# EAGLE design R2R_v2.1 (EAGLE 9.6.2)
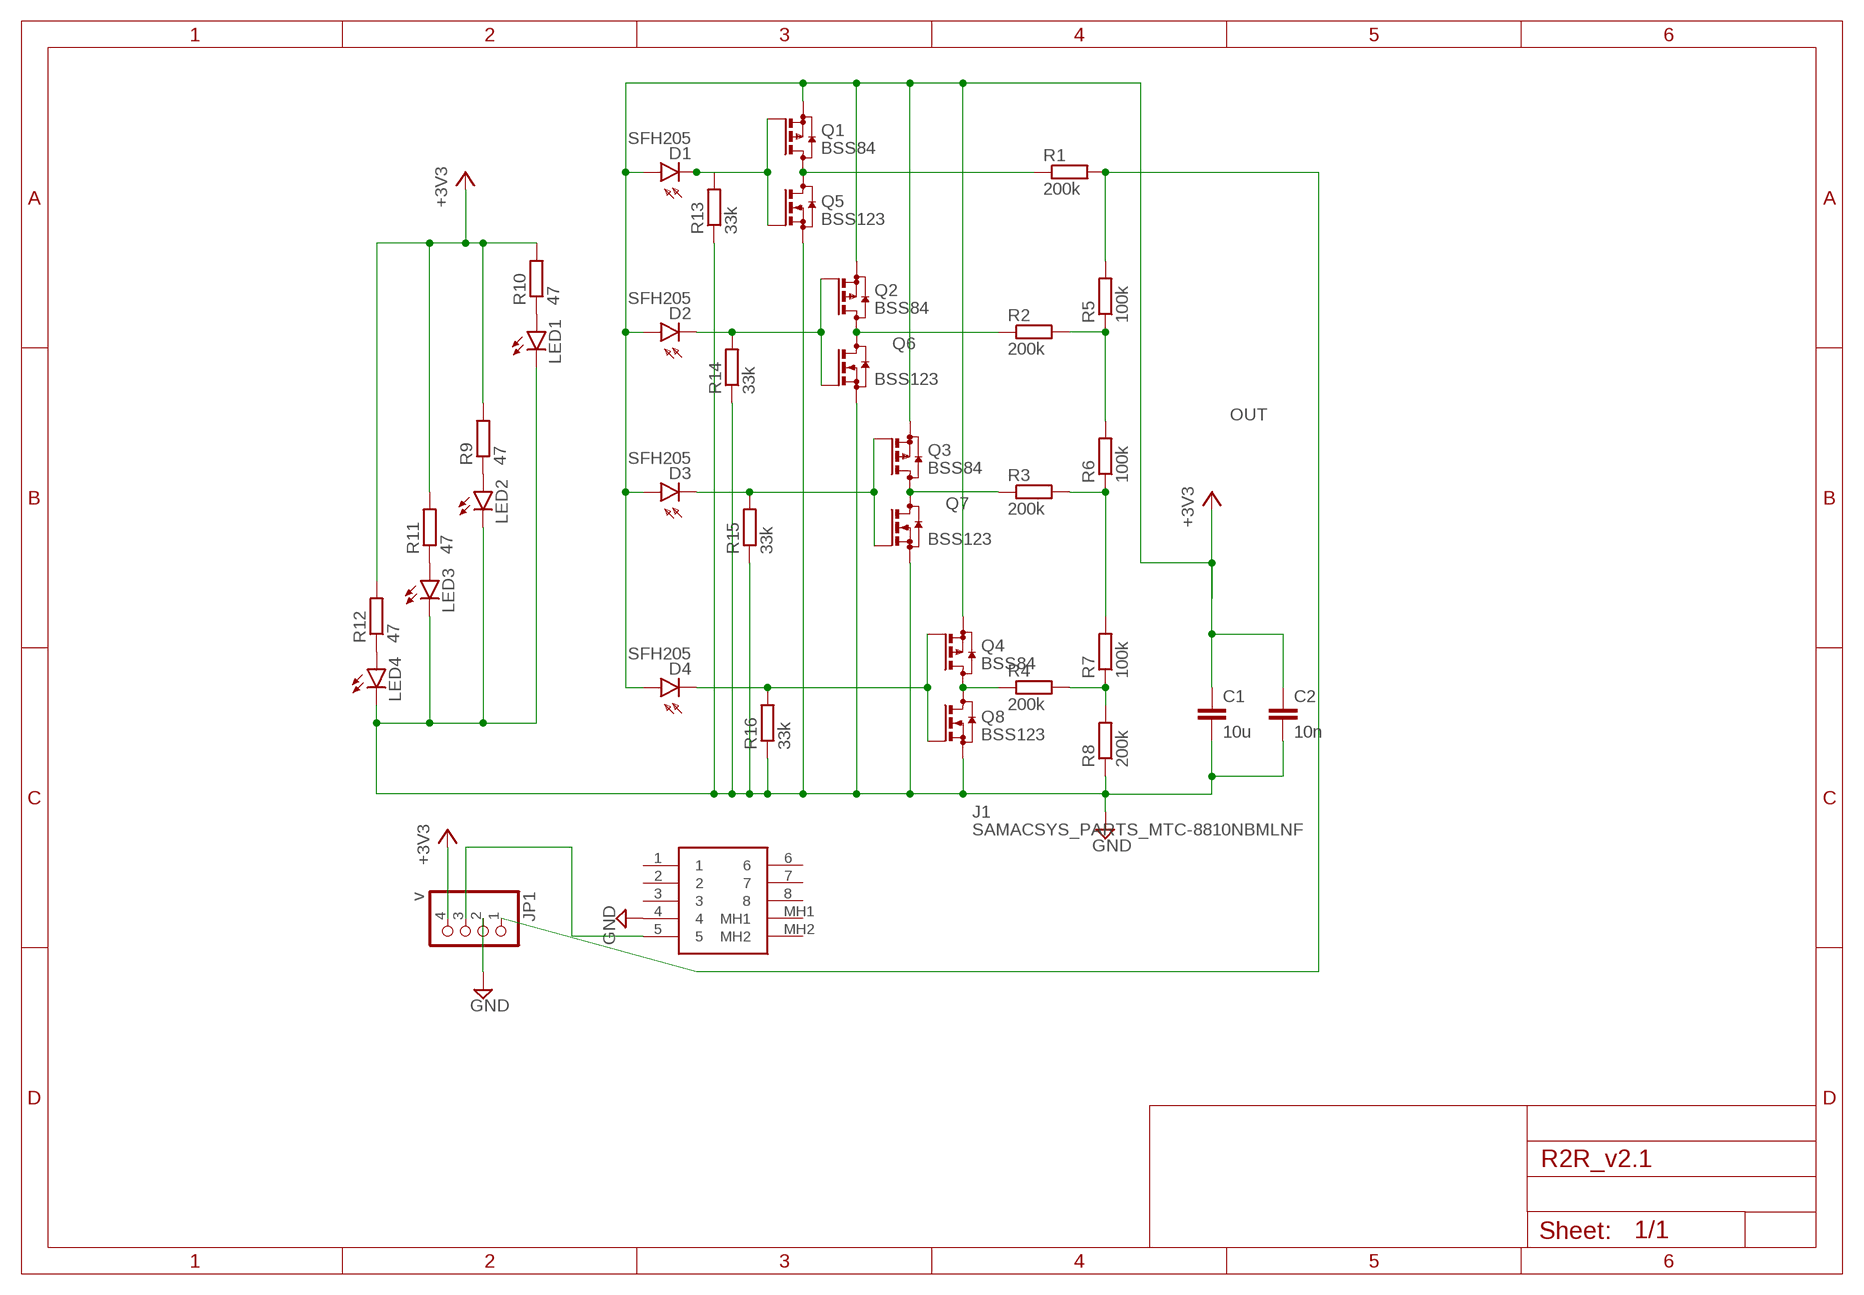
[diagram p0: schematic, sheet 1]

## Parts
C1  10u  C-EUC0805  [C0805]
C2  10n  C-EUC0805  [C0805]
D1  SFH205  [SFH205]
D2  SFH205  [SFH205]
D3  SFH205  [SFH205]
D4  SFH205  [SFH205]
J1  SAMACSYS_PARTS_MTC-8810NBMLNF  [SAMACSYS_PARTS_MTC8810NBMLNF]
JP1  v  PINHD-1X4  [1X04]
LED1  LED3MM  [LED3MM]
LED2  LED3MM  [LED3MM]
LED3  LED3MM  [LED3MM]
LED4  LED3MM  [LED3MM]
Q1  BSS84  [SOT23]
Q2  BSS84  [SOT23]
Q3  BSS84  [SOT23]
Q4  BSS84  [SOT23]
Q5  BSS123  [SOT23]
Q6  BSS123  [SOT23]
Q7  BSS123  [SOT23]
Q8  BSS123  [SOT23]
R1  200k  R-EU_R1206  [R1206]
R2  200k  R-EU_R1206  [R1206]
R3  200k  R-EU_R1206  [R1206]
R4  200k  R-EU_R1206  [R1206]
R5  100k  R-EU_R1206  [R1206]
R6  100k  R-EU_R1206  [R1206]
R7  100k  R-EU_R1206  [R1206]
R8  200k  R-EU_R1206  [R1206]
R9  47  R-EU_R1206  [R1206]
R10  47  R-EU_R1206  [R1206]
R11  47  R-EU_R1206  [R1206]
R12  47  R-EU_R1206  [R1206]
R13  33k  R-EU_R1206  [R1206]
R14  33k  R-EU_R1206  [R1206]
R15  33k  R-EU_R1206  [R1206]
R16  33k  R-EU_R1206  [R1206]

## Nets
+3V3: C1.1 C2.1 D1.A D2.A D3.A D4.A JP1.4 Q1.2(S) Q2.2(S) Q3.2(S) Q4.2(S) R9.2 R10.2 R11.2 R12.2
GND: C1.2 C2.2 J1.4 JP1.2 LED1.K(C) LED2.K(C) LED3.K(C) LED4.K(C) Q5.2(S) Q6.2(S) Q7.2(S) Q8.2(S) R8.1 R13.1 R14.1 R15.1 R16.1
N$1: Q1.3(D) Q5.3(D) R1.1
N$2: R2.2 R5.1 R6.2
N$3: R3.2 R6.1 R7.2
N$4: R4.2 R7.1 R8.2
N$5: D4.K(C) Q4.1(G) Q8.1(G) R16.2
N$6: Q3.3(D) Q7.3(D) R3.1
N$7: D2.K(C) Q2.1(G) Q6.1(G) R14.2
N$8: D1.K(C) Q1.1(G) Q5.1(G) R13.2
N$9: LED1.A R10.1
N$10: LED2.A R9.1
N$11: LED3.A R11.1
N$12: LED4.A R12.1
N$13: Q2.3(D) Q6.3(D) R2.1
N$14: J1.5 JP1.3
N$15: D3.K(C) Q3.1(G) Q7.1(G) R15.2
N$16: Q4.3(D) Q8.3(D) R4.1
OUT: JP1.1 R1.2 R5.2
Unconnected: J1.1 J1.2 J1.3 J1.6 J1.7 J1.8 J1.MH1 J1.MH2

## Library data of the parts
C1 C2 = rcl:C-EU: CAPACITOR, European symbol; SPICEPREFIX: C
D1-D4 = opto-trans-siemens:SFH205: PHOTO DIODE; OC_FARNELL: unknown; OC_NEWARK: unknown
J1 = Samac-RJ45:SAMACSYS_PARTS_MTC-8810NBMLNF: RS PRO Female Cat5 RJ45 Connector, PCB Mount RS Pro Cat5 RJ45 Connector Socket, Unshielded, Right Angle, PCB Mount Source: Datasheet <https://docs.rs-online.com/6e50/0900766b815bdd23.pdf>; DESCRIPTION: RS PRO Female Cat5 RJ45 Connector, PCB Mount RS Pro Cat5 RJ45 Connector Socket, Unshielded, Right Angle, PCB Mount; HEIGHT: 14.5mm; MANUFACTURER_NAME: RS Components; MANUFACTURER_PART_NUMBER: MTC-8810NBMLNF
JP1 = pinhead:PINHD-1X4: PIN HEADER
LED1-LED4 = led:LED: LED OSRAM: - CHIPLED LG R971, LG N971, LY N971, LG Q971, LY Q971, LO R971, LY R971 LH N974, LH R974 LS Q976, LO Q976, LY Q976 LO Q996 - Hyper CHIPLED LW Q18S LB Q993, LB Q99A, LB R99A - SideLED LS A670, LO A670, LY A670, LG A670, LP A670 LB A673, LV A673, LT A673, LW A673 LH A674 LY A675 LS A676, LA A676, LO A676, LY A676, LW A676 LS A679, LY A679, LG A679 - Hyper Micro SIDELED® LS Y876, LA Y876, LO Y876, LY Y876 LT Y87S - SmartLED LW L88C, LW L88S LB L89C, LB L89S, LG L890 LS L89K, LO L89K, LY L89K LS L896, LA L896, LO L896, LY L896 - TOPLED LS T670, LO T670, LY T670, LG T670, LP T670 LSG T670, LSP T670, LSY T670, LOP T670, LYG T670 LG T671, LOG T671, LSG T671 LB T673, LV T673, LT T673, LW T673 LH T674 LS T676, LA T676, LO T676, LY T676, LB T676, LH T676, LSB T676, LW T676 LB T67C, LV T67C, LT T67C, LS T67K, LO T67K, LY T67K, LW E67C LS E67B, LA E67B, LO E67B, LY E67B, LB E67C, LV E67C, LT E67C LW T67C LS T679, LY T679, LG T679 LS T770, LO T770, LY T770, LG T770, LP T770 LB T773, LV T773, LT T773, LW T773 LH T774 LS E675, LA E675, LY E675, LS T675 LS T776, LA T776, LO T776, LY T776, LB T776 LHGB T686 LT T68C, LB T68C - Hyper Mini TOPLED® LB M676 - Mini TOPLED Santana® LG M470 LS M47K, LO M47K, LY M47K Source: http://www.osram.convergy.de LUXEON: - LUMILED® LXK2-PW12-R00, LXK2-PW12-S00, LXK2-PW14-U00, LXK2-PW14-V00 LXK2-PM12-R00, LXK2-PM12-S00, LXK2-PM14-U00 LXK2-PE12-Q00, LXK2-PE12-R00, LXK2-PE12-S00, LXK2-PE14-T00, LXK2-PE14-U00 LXK2-PB12-K00, LXK2-PB12-L00, LXK2-PB12-M00, LXK2-PB14-N00, LXK2-PB14-P00, LXK2-PB14-Q00 LXK2-PR12-L00, LXK2-PR12-M00, LXK2-PR14-Q00, LXK2-PR14-R00 LXK2-PD12-Q00, LXK2-PD12-R00, LXK2-PD12-S00 LXK2-PH12-R00, LXK2-PH12-S00 LXK2-PL12-P00, LXK2-PL12-Q00, LXK2-PL12-R00 Source: www.luxeon.com KINGBRIGHT: KA-3528ASYC Source: www.kingbright.com
Q1-Q4 = transistor-small-signal:BSS84: P-CHANNEL MOS FET
Q5-Q8 = transistor-small-signal:BSS123: N-CHANNEL MOS FET
R1-R16 = rcl:R-EU_: RESISTOR, European symbol; SPICEPREFIX: R

## Board
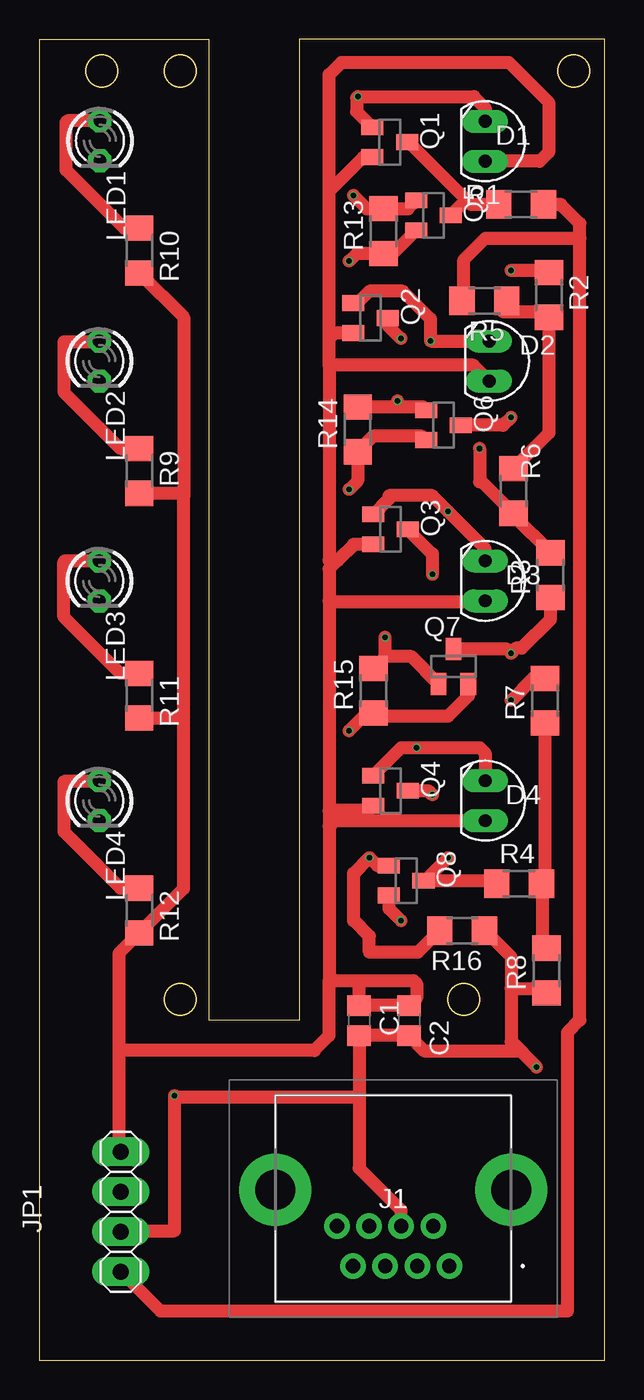
[diagram p1: board, top side]
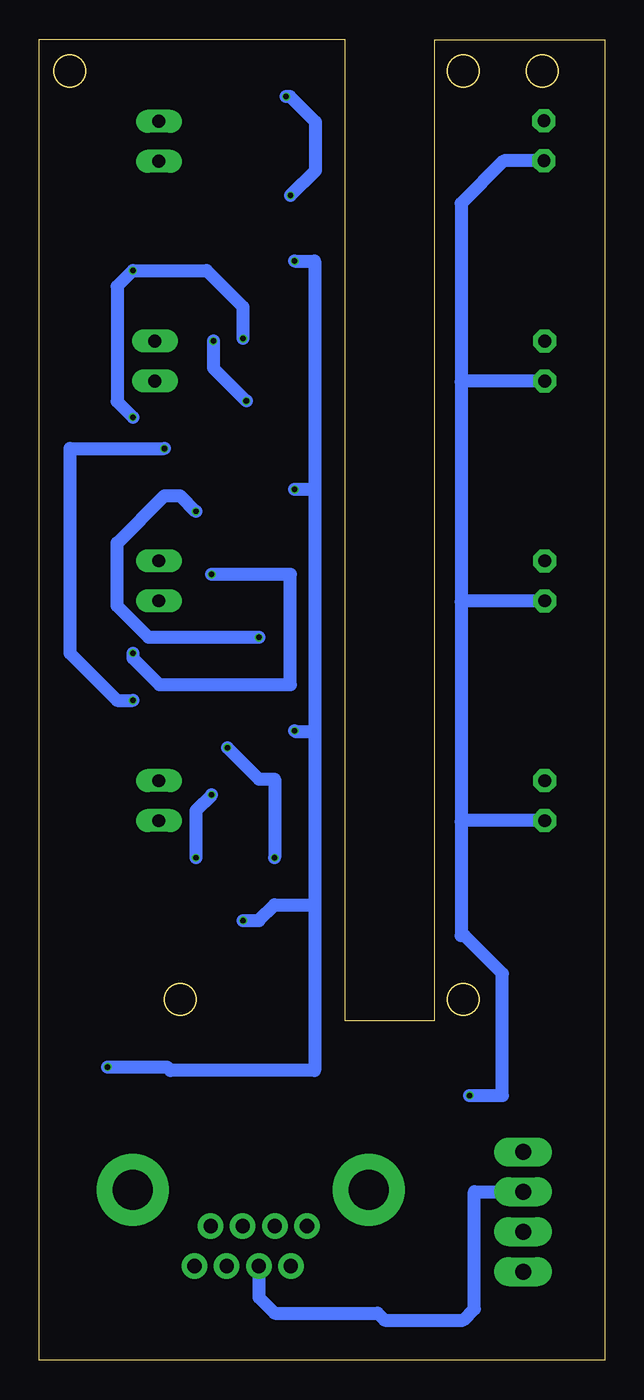
[diagram p2: board, bottom side, seen from below]

Size 35.91 x 83.95 mm. Coordinates in mm from the lower left corner, seen from the top.
Outline: 0,0 35.91,0 35.91,83.95 16.51,83.95 16.51,21.59 10.79,21.59 10.79,83.94 0,83.94 0,0
Outline: circle at 3.96,81.94 radius 1
Outline: circle at 8.96,81.94 radius 1
Outline: circle at 8.96,22.93 radius 1
Outline: circle at 26.96,22.93 radius 1
Outline: circle at 33.97,81.94 radius 1
Copper layers (1*16): Top 0.035mm / dielectric 1.6mm / Bottom 0.035mm
Design rules "jlcpcb-2layers": minimum track width 5mil, minimum drill 0.3mm, track to track 5mil, track to pad 5mil, pad to pad 5mil, via to via 5mil, smd to smd 5mil, copper to edge 0.2mm, drill to drill 6mil, minimum pad ring 10mil, minimum via ring 3mil, stop-mask expansion 4mil, vias tented up to drill 0mil, thermal gap 10mil

### Footprints (pad centres in the part's own frame; a part is rotated, then mirrored left to right if it is on the bottom)
C0805 = smd 1.3 x 1.5: 1 -0.95,0; 2 0.95,0
SFH205 = drill 0.813 long: A 0,-1.27; K 0,1.27
SAMACSYS_PARTS_MTC8810NBMLNF = drill 0.9 pad 1.4: 1 0,0; 2 1.02,-2.54; 3 2.04,0; 4 3.06,-2.54; 5 4.08,0; 6 5.1,-2.54; 7 6.12,0; 8 7.14,-2.54 | drill 2.55 pad 3.825: MH1 -3.93,-4.84; MH2 11.07,-4.84
1X04 = drill 1.016 long: 1 -3.81,0; 2 -1.27,0; 3 1.27,0; 4 3.81,0
LED3MM = drill 0.813 octagon: A -1.27,0; K 1.27,0
SOT23 = smd 1 x 1.4: 1 -0.95,-1.1; 2 0.95,-1.1; 3 0,1.1
R1206 = smd 1.6 x 1.803: 1 -1.422,0; 2 1.422,0

### Placement (x,y rotation side)
C1  20.32,21.59 270 top
C2  23.5,21.59 270 top
D1  28.32,77.47 0 top
D2  28.57,63.5 0 top
D3  28.32,49.53 0 top
D4  28.32,35.56 0 top
J1  26.05,5.98 180 top
JP1  5.17,9.43 90 top
LED1  3.85,77.5 270 top
LED2  3.81,63.5 270 top
LED3  3.81,49.53 270 top
LED4  3.81,35.56 270 top
Q1  22.26,77.4 270 top
Q2  21.04,66.23 270 top
Q3  22.3,52.8 270 top
Q4  22.3,36.2 270 top
Q5  25.04,72.75 270 top
Q6  25.67,59.42 270 top
Q7  26.3,44.09 0 top
Q8  23.3,30.48 270 top
R1  30.61,73.45 0 top
R2  32.37,67.69 270 top
R3  32.48,49.9 90 top
R4  30.48,30.29 0 top
R5  28.27,67.31 180 top
R6  30.11,55.25 90 top
R7  32.12,41.91 90 top
R8  32.21,24.76 90 top
R9  6.35,56.52 270 top
R10  6.35,70.52 270 top
R11  6.35,42.23 270 top
R12  6.35,28.57 270 top
R13  21.86,71.75 90 top
R14  20.23,59.15 90 top
R15  21.23,42.55 90 top
R16  26.86,27.3 180 top

### Tracks (layer width: path | path; a pad name or v marks a point on that pad's centre or on a via)
+3V3
  Top 0.813: 20.32,24.13 C1.1 C2.1 23.96,23.01 23.96,23.93 23.77,24.13 20.32,24.13 | R10.2 9.17,66.27 9.17,54.86 | 5.04,19.68 17.46,19.68 18.41,20.63 18.41,24.13 | 18.41,63.23 18.41,64.94 | 18.41,64.94 18.41,74.3 | 18.41,63.23 27.57,63.23 D2.A | 18.41,63.23 18.41,50.85 18.96,50.85 | 18.41,48.26 18.41,34.94 | 18.41,34.94 18.41,33.94 | 18.41,33.94 18.41,24.13 | 18.41,24.13 20.32,24.13 | Q1.2 20.57,76.45 18.41,74.3 | 18.41,74.3 18.41,81.7 19.2,82.48 29.81,82.48 32.35,79.95 32.35,76.77 31.78,76.2 D1.A | Q2.2 18.76,65.28 18.41,64.94 | Q3.2 19.96,51.85 18.96,50.85 | 18.96,50.85 18.41,50.3 18.41,48.26 | Q4.2 20.89,34.94 18.41,34.94 | 18.41,33.94 18.77,34.29 D4.A | D3.A 28.25,48.2 18.48,48.2 18.41,48.26 | R9.2 8.94,55.09 9.17,54.86 | 9.17,40.89 9.17,29.97 R12.2 5.04,25.85 5.04,19.68 | 9.17,40.89 9.17,54.86 | R11.2 9.08,40.8 9.17,40.89 | 5.04,19.68 5.04,13.37 JP1.4
GND  (via drill 0.35)
  Top 0.813: v19.68,69.85 20.17,70.33 R13.1 22.46,70.33 Q5.2 | v19.68,55.34 20.23,55.88 R14.1 21.23,58.73 24.31,58.73 Q6.2 | v19.68,40.01 20.8,41.12 R15.1 21.41,40.94 25.96,40.94 27.25,42.23 Q7.2 | 29.96,23.64 29.96,20.25 v31.57,18.64 30.57,19.64 24.5,19.64 C2.2 C1.2 20.32,16.93 | 29.96,23.64 29.96,25.62 R16.1 | R8.1 32.21,22.93 31.5,23.64 29.96,23.64 | Q8.2 22.2,28.7 v22.96,27.93 | 20.32,16.93 20.32,12.2 22.99,9.53 J1.4 | 20.32,16.93 20.12,16.73 8.67,16.73 v8.57,16.83 8.57,8.22 8.54,8.19 5.21,8.19 JP1.2
  Bottom 0.813: LED1.K 6.39,76.23 9.11,73.51 9.11,62.16 | v19.68,69.85 18.41,69.85 18.41,55.34 | 18.41,55.34 18.41,39.94 | 18.41,39.94 18.41,28.93 | 18.41,28.93 18.41,18.41 27.57,18.41 27.8,18.64 v31.57,18.64 | 18.41,55.34 v19.68,55.34 | v19.68,40.01 19.62,39.94 18.41,39.94 | v22.96,27.93 21.96,27.93 20.96,28.93 18.41,28.93 | LED2.K 9.05,62.23 9.11,62.16 | 9.11,62.16 9.11,48.2 | LED3.K 9.05,48.26 9.11,48.2 | v8.57,16.83 6.49,16.83 6.49,24.57 8.9,26.98 9.11,26.98 9.11,34.23 | 9.11,48.2 9.11,34.23 | LED4.K 9.05,34.29 9.11,34.23
N$1
  Top 0.813: Q1.3 23.46,77.4 27.12,73.74 | Q5.3 27.12,73.74 | R1.1 27.41,73.45 27.12,73.74
N$2
  Top 0.813: R6.2 32.37,58.92 R2.2 32.03,66.61 29.49,66.61 29.49,67.11 R5.1
N$3  (via drill 0.35)
  Top 0.813: R3.2 30.11,53.68 R6.1 28.11,55.82 27.96,55.82 v27.96,57.94 | v29.96,41.94 31.36,43.33 R7.2
  Bottom 0.813: v27.96,57.94 33.97,57.94 33.97,44.94 30.96,41.94 v29.96,41.94
N$4
  Top 0.813: R7.1 32.12,30.5 R4.2 31.96,30.23 31.96,26.43 R8.2
N$5  (via drill 0.35)
  Top 0.813: Q4.1 23,38.94 v23.96,38.94 27.96,38.94 28.32,38.58 D4.K | Q8.1 21.47,31.43 v20.96,31.93 19.96,30.93 19.96,27.93 20.96,26.93 20.96,25.93 24.07,25.93 R16.2
  Bottom 0.813: v23.96,38.94 21.96,36.94 20.96,36.94 v20.96,31.93
N$6  (via drill 0.35)
  Top 0.813: Q7.3 29.71,45.19 v29.96,44.94 30.28,45.25 30.65,45.25 32.48,47.09 R3.1 | Q3.3 24.96,51.24 v24.96,49.94
  Bottom 0.813: v29.96,44.94 29.96,44.62 28.28,42.94 19.96,42.94 19.96,49.94 v24.96,49.94
N$7  (via drill 0.35)
  Top 0.813: Q6.1 24.37,60.57 R14.2 22.77,60.57 v22.77,60.96 | D2.K v24.86,64.77 24.86,66.18 23.1,67.94 20.96,67.94 20.21,67.18 Q2.1
  Bottom 0.813: v24.86,64.77 24.86,63.05 v22.77,60.96
N$8  (via drill 0.35)
  Top 0.813: Q5.1 23.41,73.18 R13.2 20.8,73.18 v19.95,74.03 | Q1.1 20.16,79.35 20.16,80.23 v20.23,80.3 27.6,80.3 28.32,79.58 D1.K
  Bottom 0.813: v20.23,80.3 19.98,80.3 18.38,78.7 18.38,75.6 v19.95,74.03
N$9
  Top 0.813: LED1.A 1.78,78.77 1.68,78.67 1.68,75.65 5.4,71.94 R10.1
N$10
  Top 0.813: LED2.A 3.74,64.7 1.55,64.7 1.55,61.53 5.15,57.94 R9.1
N$11
  Top 0.813: LED3.A 1.62,50.8 1.55,50.73 1.55,47.24 5.15,43.65 R11.1
N$12
  Top 0.813: LED4.A 3.74,36.77 1.55,36.77 1.55,33.59 5.15,30 R12.1
N$13  (via drill 0.35)
  Top 0.813: Q2.3 22.14,65.77 v22.96,64.94 | R2.1 32.23,69.25 v29.96,69.25 | v29.96,59.94 29.45,59.42 Q6.3
  Bottom 0.813: v22.96,64.94 22.96,66.94 25.28,69.25 v29.96,69.25 30.96,68.25 30.96,60.94 v29.96,59.94
N$14
  Bottom 0.813: J1.5 21.97,3.98 20.97,2.98 14.41,2.98 13.97,2.54 8.98,2.54 8.27,3.25 8.27,10.7 JP1.3
N$15  (via drill 0.35)
  Top 0.813: Q3.1 22.2,54.75 22.2,54.94 24.96,54.94 v25.96,53.94 28.32,51.58 D3.K | 21.96,44.71 R15.2 | 21.96,44.71 v21.96,45.94 | 21.96,44.71 23.63,44.71 Q7.1
  Bottom 0.813: v21.96,45.94 28.96,45.94 30.96,47.94 30.96,51.94 27.96,54.94 26.96,54.94 v25.96,53.94
N$16  (via drill 0.35)
  Top 0.813: Q4.3 24.7,36.2 v24.96,35.94 | R4.1 28.87,30.48 Q8.3 24.51,30.48 v25.96,31.93
  Bottom 0.813: v24.96,35.94 25.96,34.94 v25.96,31.93
OUT
  Top 0.813: JP1.1 5.2,5.62 7.71,3.11 33.54,3.11 33.54,20.81 34.35,21.62 34.35,71.3 | 34.35,71.3 34.35,72.24 33.14,73.45 R1.2 | R5.2 26.96,67.42 26.96,69.94 28.33,71.3 34.35,71.3